# Altium schematic sheet emmc.SchDoc
size 350 x 219 mm; SheetNumber: 2; SheetTotal: 2
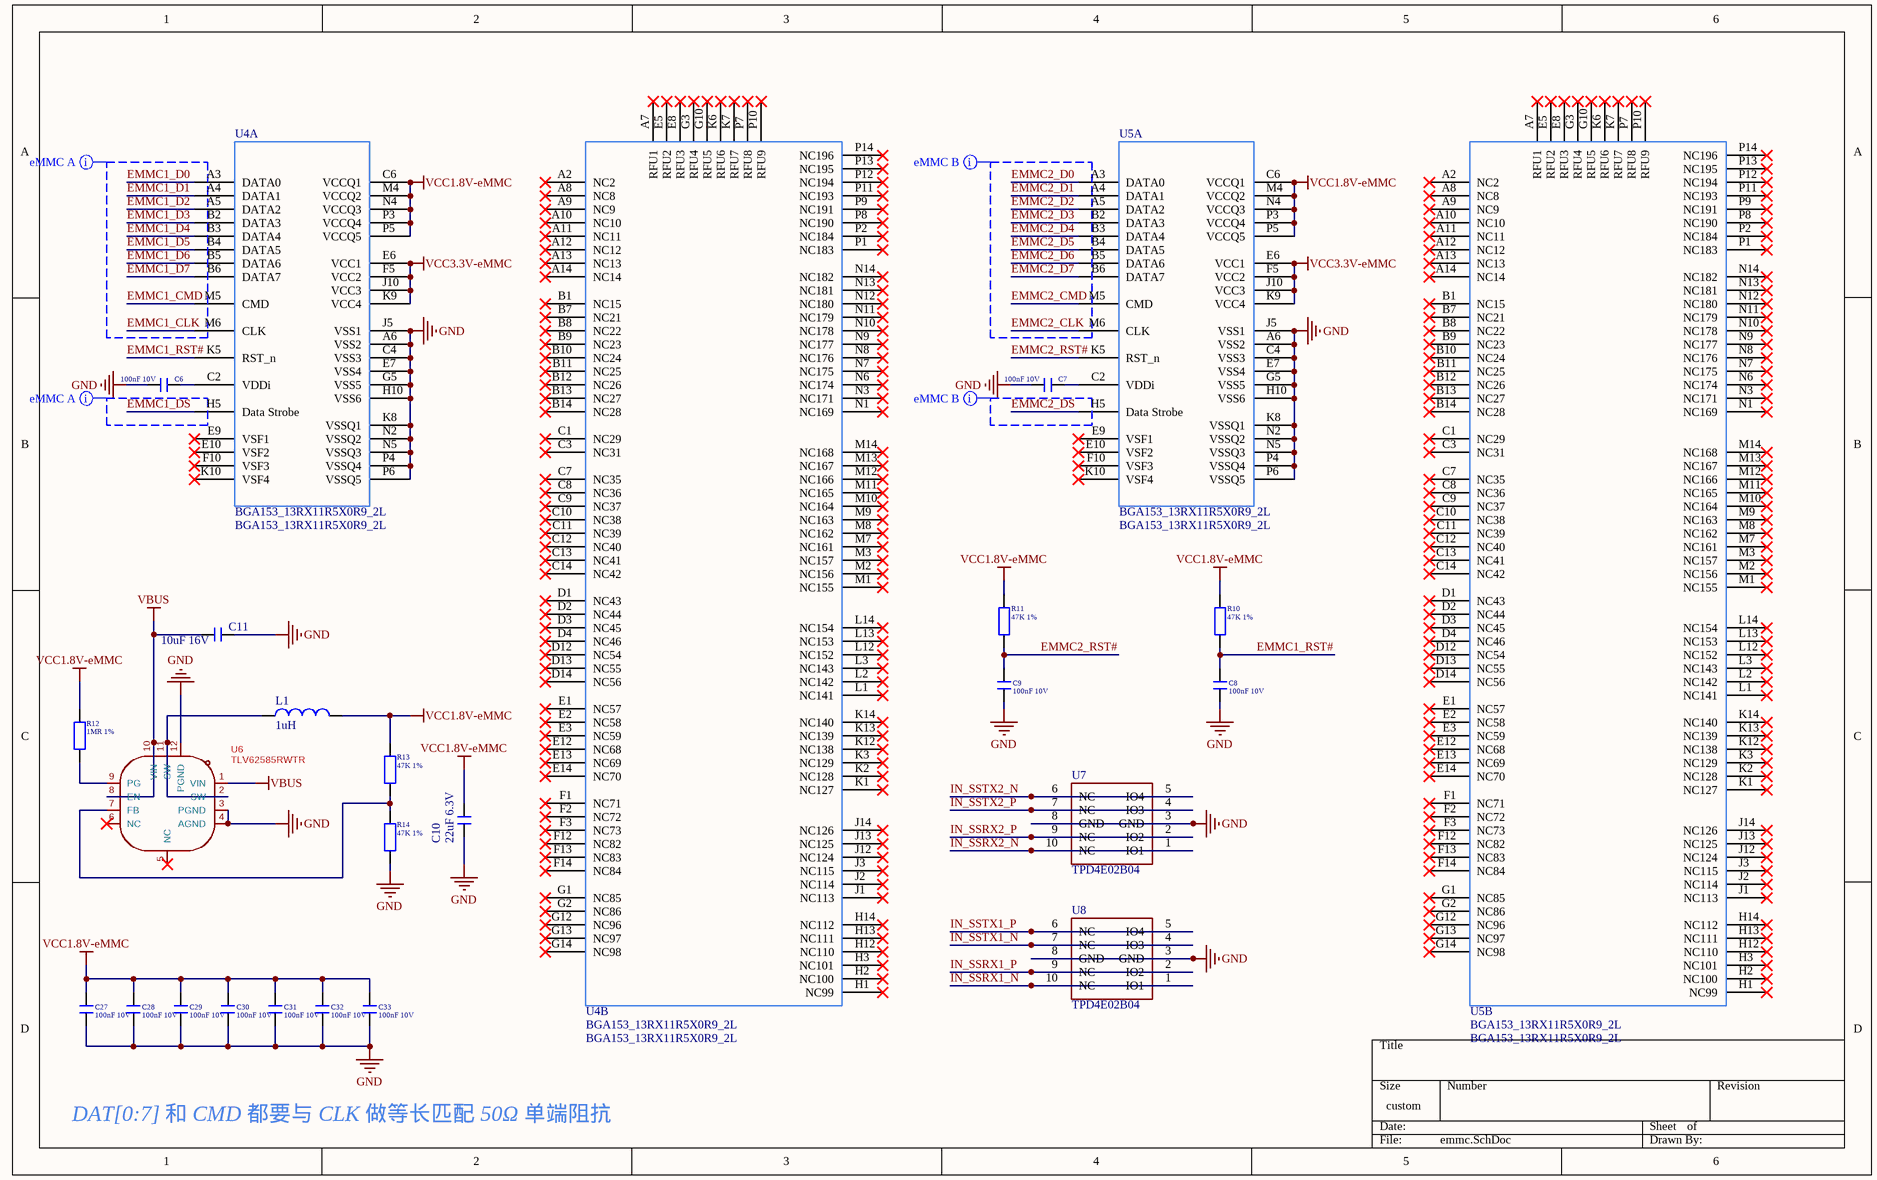
[diagram p0: emmc.SchDoc]

## Parts
C6  100nF 10V  [C0402_NS]
C7  100nF 10V  [C0402_NS]
C8  100nF 10V  [C0402_NS]
C9  100nF 10V  [C0402_NS]
C10  22uF 6.3V  [C0402_NS]
C11  10uF 16V  [C0402_NS]
C27  100nF 10V  [C0603_NS]
C28  100nF 10V  [C0603_NS]
C29  100nF 10V  [C0603_NS]
C30  100nF 10V  [C0603_NS]
C31  100nF 10V  [C0603_NS]
C32  100nF 10V  [C0603_NS]
C33  100nF 10V  [C0603_NS]
L1  1uH  [L 0805_L]
R10  47K 1%  [R0402_NS]
R11  47K 1%  [R0402_NS]
R12  1MR 1%  [R0402_NS]
R13  47K 1%  [R0402_NS]
R14  47K 1%  [R0402_NS]
U4  BGA153_13RX11R5X0R9_2L  [FBGA-153_L13.0-W11.5-P0.50_KLMAG1JETD-B041]  (parts A,B of 2)
U5  BGA153_13RX11R5X0R9_2L  [FBGA-153_L13.0-W11.5-P0.50_KLMAG1JETD-B041]  (parts A,B of 2)
U6  TLV62585RWTR  [VQFN-HR-12_L2.0-W2.0-P0.50-BL]
U7  TPD4E02B04  [DIO_TPD4E02B04DQAR]
U8  TPD4E02B04  [DIO_TPD4E02B04DQAR]

## Nets
GND: C6.2 C7.2 C8.2 C9.2 C10.1 C11.1 C27.2 C28.2 C29.2 C30.2 C31.2 C32.2 C33.2 R14.2 U4.A6(VSS2) U4.C4(VSS3) U4.E7(VSS4) U4.G5(VSS5) U4.H10(VSS6) U4.J5(VSS1) U4.K8(VSSQ1) U4.N2(VSSQ2) U4.N5(VSSQ3) U4.P4(VSSQ4) U4.P6(VSSQ5) U5.A6(VSS2) U5.C4(VSS3) U5.E7(VSS4) U5.G5(VSS5) U5.H10(VSS6) U5.J5(VSS1) U5.K8(VSSQ1) U5.N2(VSSQ2) U5.N5(VSSQ3) U5.P4(VSSQ4) U5.P6(VSSQ5) U6.3(PGND) U6.4(AGND) U6.12(PGND) U7.3(GND) U7.8(GND) U8.3(GND) U8.8(GND)
VBUS: C11.2 U6.1(VIN) U6.8(EN) U6.10(VIN)
VCC1.8V-eMMC: C10.2 C27.1 C28.1 C29.1 C30.1 C31.1 C32.1 C33.1 L1.2 R10.1 R11.1 R12.1 R13.1 U4.C6(VCCQ1) U4.M4(VCCQ2) U4.N4(VCCQ3) U4.P3(VCCQ4) U4.P5(VCCQ5) U5.C6(VCCQ1) U5.M4(VCCQ2) U5.N4(VCCQ3) U5.P3(VCCQ4) U5.P5(VCCQ5)
VCC3.3V-eMMC: U4.E6(VCC1) U4.F5(VCC2) U4.J10(VCC3) U4.K9(VCC4) U5.E6(VCC1) U5.F5(VCC2) U5.J10(VCC3) U5.K9(VCC4)
EMMC1_CLK: U4.M6(CLK)
EMMC1_CMD: U4.M5(CMD)
EMMC1_D0: U4.A3(DATA0)
EMMC1_D1: U4.A4(DATA1)
EMMC1_D2: U4.A5(DATA2)
EMMC1_D3: U4.B2(DATA3)
EMMC1_D4: U4.B3(DATA4)
EMMC1_D5: U4.B4(DATA5)
EMMC1_D6: U4.B5(DATA6)
EMMC1_D7: U4.B6(DATA7)
EMMC1_DS: U4.H5(Data_Strobe)
EMMC1_RST#: C8.1 R10.2 U4.K5(RST_n)
EMMC2_CLK: U5.M6(CLK)
EMMC2_CMD: U5.M5(CMD)
EMMC2_D0: U5.A3(DATA0)
EMMC2_D1: U5.A4(DATA1)
EMMC2_D2: U5.A5(DATA2)
EMMC2_D3: U5.B2(DATA3)
EMMC2_D4: U5.B3(DATA4)
EMMC2_D5: U5.B4(DATA5)
EMMC2_D6: U5.B5(DATA6)
EMMC2_D7: U5.B6(DATA7)
EMMC2_DS: U5.H5(Data_Strobe)
EMMC2_RST#: C9.1 R11.2 U5.K5(RST_n)
IN_SSRX1_N: U8.1(IO1) U8.10(NC)
IN_SSRX1_P: U8.2(IO2) U8.9(NC)
IN_SSRX2_N: U7.1(IO1) U7.10(NC)
IN_SSRX2_P: U7.2(IO2) U7.9(NC)
IN_SSTX1_N: U8.4(IO3) U8.7(NC)
IN_SSTX1_P: U8.5(IO4) U8.6(NC)
IN_SSTX2_N: U7.5(IO4) U7.6(NC)
IN_SSTX2_P: U7.4(IO3) U7.7(NC)
NetC6_1: C6.1 U4.C2(VDDi)
NetC7_1: C7.1 U5.C2(VDDi)
NetL1_1: L1.1 U6.2(SW) U6.11(SW)
NetR12_2: R12.2 U6.9(PG)
NetR13_2: R13.2 R14.1 U6.7(FB)

Not connected (* = marked no-connect by the designer): U4 A2(NC2)* A7(RFU1)* A8(NC8)* A9(NC9)* A10(NC10)* A11(NC11)* A12(NC12)* A13(NC13)* A14(NC14)* B1(NC15)* B7(NC21)* B8(NC22)* B9(NC23)* B10(NC24)* B11(NC25)* B12(NC26)* B13(NC27)* B14(NC28)* C1(NC29)* C3(NC31)* C7(NC35)* C8(NC36)* C9(NC37)* C10(NC38)* C11(NC39)* C12(NC40)* C13(NC41)* C14(NC42)* D1(NC43)* D2(NC44)* D3(NC45)* D4(NC46)* D12(NC54)* D13(NC55)* D14(NC56)* E1(NC57)* E2(NC58)* E3(NC59)* E5(RFU2)* E8(RFU3)* E9(VSF1)* E10(VSF2)* E12(NC68)* E13(NC69)* E14(NC70)* F1(NC71)* F2(NC72)* F3(NC73)* F10(VSF3)* F12(NC82)* F13(NC83)* F14(NC84)* G1(NC85)* G2(NC86)* G3(RFU4)* G10(RFU5)* G12(NC96)* G13(NC97)* G14(NC98)* H1(NC99)* H2(NC100)* H3(NC101)* H12(NC110)* H13(NC111)* H14(NC112)* J1(NC113)* J2(NC114)* J3(NC115)* J12(NC124)* J13(NC125)* J14(NC126)* K1(NC127)* K2(NC128)* K3(NC129)* K6(RFU6)* K7(RFU7)* K10(VSF4)* K12(NC138)* K13(NC139)* K14(NC140)* L1(NC141)* L2(NC142)* L3(NC143)* L12(NC152)* L13(NC153)* L14(NC154)* M1(NC155)* M2(NC156)* M3(NC157)* M7(NC161)* M8(NC162)* M9(NC163)* M10(NC164)* M11(NC165)* M12(NC166)* M13(NC167)* M14(NC168)* N1(NC169)* N3(NC171)* N6(NC174)* N7(NC175)* N8(NC176)* N9(NC177)* N10(NC178)* N11(NC179)* N12(NC180)* N13(NC181)* N14(NC182)* P1(NC183)* P2(NC184)* P7(RFU8)* P8(NC190)* P9(NC191)* P10(RFU9)* P11(NC193)* P12(NC194)* P13(NC195)* P14(NC196)*; U5 A2(NC2)* A7(RFU1)* A8(NC8)* A9(NC9)* A10(NC10)* A11(NC11)* A12(NC12)* A13(NC13)* A14(NC14)* B1(NC15)* B7(NC21)* B8(NC22)* B9(NC23)* B10(NC24)* B11(NC25)* B12(NC26)* B13(NC27)* B14(NC28)* C1(NC29)* C3(NC31)* C7(NC35)* C8(NC36)* C9(NC37)* C10(NC38)* C11(NC39)* C12(NC40)* C13(NC41)* C14(NC42)* D1(NC43)* D2(NC44)* D3(NC45)* D4(NC46)* D12(NC54)* D13(NC55)* D14(NC56)* E1(NC57)* E2(NC58)* E3(NC59)* E5(RFU2)* E8(RFU3)* E9(VSF1)* E10(VSF2)* E12(NC68)* E13(NC69)* E14(NC70)* F1(NC71)* F2(NC72)* F3(NC73)* F10(VSF3)* F12(NC82)* F13(NC83)* F14(NC84)* G1(NC85)* G2(NC86)* G3(RFU4)* G10(RFU5)* G12(NC96)* G13(NC97)* G14(NC98)* H1(NC99)* H2(NC100)* H3(NC101)* H12(NC110)* H13(NC111)* H14(NC112)* J1(NC113)* J2(NC114)* J3(NC115)* J12(NC124)* J13(NC125)* J14(NC126)* K1(NC127)* K2(NC128)* K3(NC129)* K6(RFU6)* K7(RFU7)* K10(VSF4)* K12(NC138)* K13(NC139)* K14(NC140)* L1(NC141)* L2(NC142)* L3(NC143)* L12(NC152)* L13(NC153)* L14(NC154)* M1(NC155)* M2(NC156)* M3(NC157)* M7(NC161)* M8(NC162)* M9(NC163)* M10(NC164)* M11(NC165)* M12(NC166)* M13(NC167)* M14(NC168)* N1(NC169)* N3(NC171)* N6(NC174)* N7(NC175)* N8(NC176)* N9(NC177)* N10(NC178)* N11(NC179)* N12(NC180)* N13(NC181)* N14(NC182)* P1(NC183)* P2(NC184)* P7(RFU8)* P8(NC190)* P9(NC191)* P10(RFU9)* P11(NC193)* P12(NC194)* P13(NC195)* P14(NC196)*; U6 5(NC)* 6(NC)*

## Layout directives
net class eMMC A; rule Width Constraint [Pref Width = 6.16mil    Min Width = 6.16mil    Max Width = 6.16mil]: EMMC1_CLK, EMMC1_CMD, EMMC1_D0, EMMC1_D1, EMMC1_D2, EMMC1_D3, EMMC1_D4, EMMC1_D5, EMMC1_D6, EMMC1_D7, EMMC1_DS
net class eMMC B; rule Width Constraint [Pref Width = 6.16mil    Min Width = 6.16mil    Max Width = 6.16mil]: EMMC2_CLK, EMMC2_CMD, EMMC2_D0, EMMC2_D1, EMMC2_D2, EMMC2_D3, EMMC2_D4, EMMC2_D5, EMMC2_D6, EMMC2_D7, EMMC2_DS

## Notes on the sheet
- DAT[0:7] 和 CMD 都要与 CLK 做等长匹配 50Ω 单端阻抗

## Library data of the parts
C6-C11 C27-C33 = C: 无极性贴片电容; 版权归属: 源创客; 材质: X7R; BOM名称: 无极性贴片电容; 学习资源: www.ooocke.com
L1 = L: 小功率贴片电感; 版权归属: 源创客; BOM名称: 小功率贴片电感; 学习资源: www.ooocke.com
R10-R14 = R: 贴片电阻; 版权归属: 源创客; BOM名称: 贴片电阻; 学习资源: www.ooocke.com
U4 U5 = INAND_EMMC_153_2L: EMMC_B153_2L,更好的满足工艺需求，Fanout方式部分走线跨接再球位上，挖除A1\C5球位; Priority: A; RK PN: EMMC_B153_2L; Part Type: NAND_FLASH; Created by: YWQ; PCB Footprint: BGA153_13RX11R5X0R9_2L
U6 = TLV62585RWTR: 功能类型:降压型;输出类型:可调;工作电压:2.5V~5.5V;输出电压:600mV~5.5V;输出电流:3A;; Manufacturer: TI(德州仪器); AddInBom: yes; ModelId: 2955a7eb91f6440293a731726d4b8758聨0819f05c4eef4c71ace90d822a990e87; ModelName: VQFN-HR-12_L2.0-W2.0-H0.9-P0.50-BL; ModelTransform: 78.74,78.74,0,90,0,0,-0.005,0.005,0; Function: 降压型; Output Type: 可调; Output Current: 3A; Switching Frequency: 1.5MHz; Synchronous Rectification: 是; Number of Outputs: 1; Topology: 降压式; Quiescent Current (Iq): 35uA; Switch tube (built-in/external): 内置; Symbol: TLV62585RWTR; Device: TLV62585RWTR; LCSC Part Name: 高效率同步降压转换器; SupplierPart: C406872; ManufacturerPart: TLV62585RWTR; Supplier Footprint: VQFN-11-HR(2x3); JLCPCB Part Class: Extended Part; Datasheet: https://www.ti.com/cn/lit/gpn/tlv62585; Supplier: LCSC; ConvertToPcb: yes; FootprintName: VQFN-HR-12_L2.0-W2.0-P0.50-BL; Input Voltage: 2.5V~5.5V; Output Voltage: 600mV~5.5V; Operating Temperature: -40℃~+125℃
U7 U8 = TPD4E02B04: ESD